# EAGLE design 2313tmpcontroller (EAGLE 7.1.0)
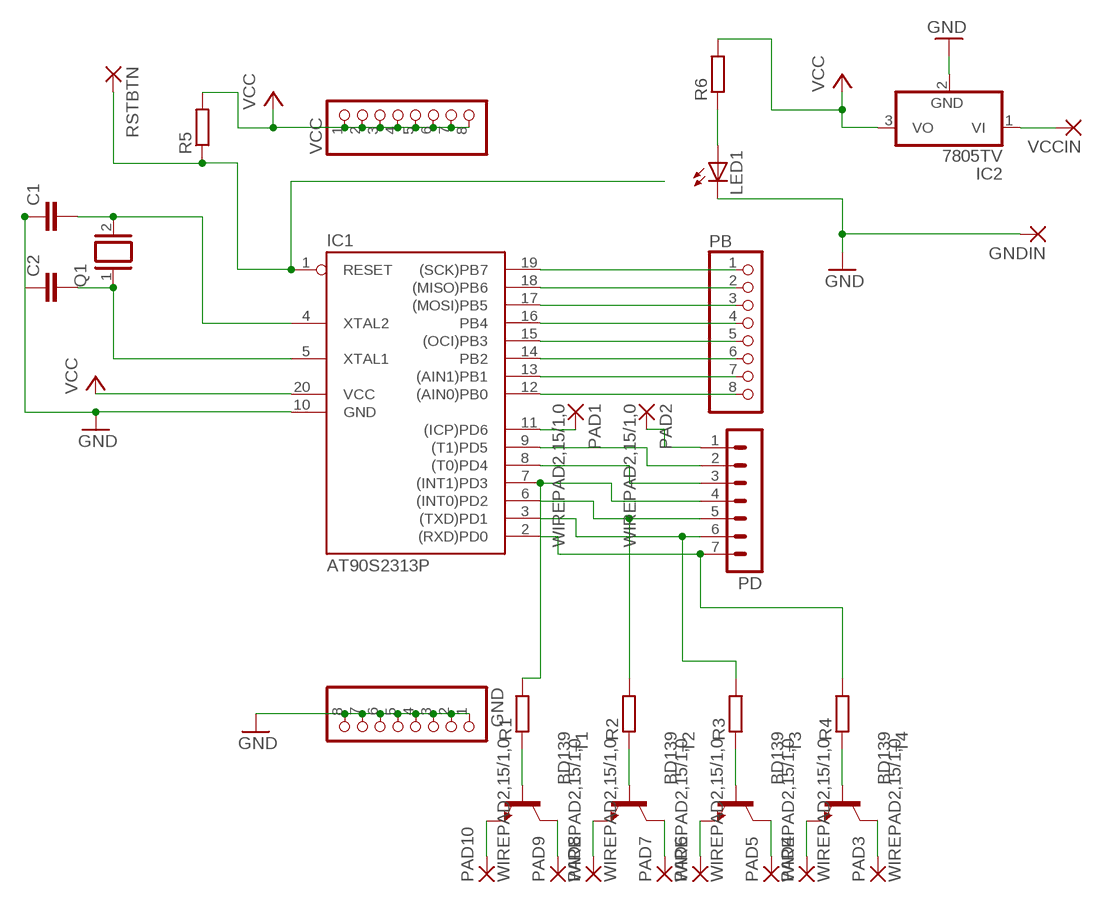
[diagram p0: schematic, sheet 1]

## Parts
C1  C2,5-3  [C2.5-3]
C2  C2,5-3  [C2.5-3]
GND  PINHD-1X8  [1X08]
GNDIN  2,54/0,8  [2,54/0,8]
IC1  AT90S2313P  [DIL20]
IC2  7805TV  [TO220V]
LED1  LEDB153  [Q62902-B153]
PAD1  WIREPAD2,15/1,0  [2,15/1,0]
PAD2  WIREPAD2,15/1,0  [2,15/1,0]
PAD3  WIREPAD2,15/1,0  [2,15/1,0]
PAD4  WIREPAD2,15/1,0  [2,15/1,0]
PAD5  WIREPAD2,15/1,0  [2,15/1,0]
PAD6  WIREPAD2,15/1,0  [2,15/1,0]
PAD7  WIREPAD2,15/1,0  [2,15/1,0]
PAD8  WIREPAD2,15/1,0  [2,15/1,0]
PAD9  WIREPAD2,15/1,0  [2,15/1,0]
PAD10  WIREPAD2,15/1,0  [2,15/1,0]
PB  PINHD-1X8  [1X08]
PD  MA07-1  [MA07-1]
Q1  XTAL/S  [QS]
R1  R-EU_0207/7  [0207/7]
R2  R-EU_0207/7  [0207/7]
R3  R-EU_0207/7  [0207/7]
R4  R-EU_0207/7  [0207/7]
R5  R-EU_0207/7  [0207/7]
R6  R-EU_0207/7  [0207/7]
RSTBTN  2,54/0,8  [2,54/0,8]
T1  BD139  [TO126]
T2  BD139  [TO126]
T3  BD139  [TO126]
T4  BD139  [TO126]
VCC  PINHD-1X8  [1X08]
VCCIN  2,54/0,8  [2,54/0,8]

## Nets
GND: C1.1 C2.1 GND.1 GND.2 GND.3 GND.4 GND.5 GND.6 GND.7 GND.8 GNDIN.1(P) IC1.10(GND) IC2.2(GND) LED1.K(C)
N$1: IC1.12((AIN0)PB0) PB.8
N$2: IC1.13((AIN1)PB1) PB.7
N$3: IC1.14(PB2) PB.6
N$4: IC1.15((OCI)PB3) PB.5
N$5: IC1.16(PB4) PB.4
N$6: IC1.17((MOSI)PB5) PB.3
N$7: IC1.18((MISO)PB6) PB.2
N$8: IC1.19((SCK)PB7) PB.1
N$9: IC1.2((RXD)PD0) PD.7 R4.2
N$10: IC1.3((TXD)PD1) PD.6 R3.2
N$11: IC1.6((INT0)PD2) PD.5 R2.2
N$12: IC1.7((INT1)PD3) PD.4 R1.2
N$13: IC1.8((T0)PD4) PD.3
N$14: IC1.9((T1)PD5) PD.2
N$15: IC1.11((ICP)PD6) PAD1.1(P)
N$16: C2.2 IC1.5(XTAL1) Q1.1
N$17: C1.2 IC1.4(XTAL2) Q1.2
N$18: R1.1 T1.3(B)
N$19: IC1.1(RESET) R5.1 RSTBTN.1(P)
N$20: R2.1 T2.3(B)
N$21: R3.1 T3.3(B)
N$22: R4.1 T4.3(B)
N$23: PAD10.1(P) T1.1(E)
N$24: PAD9.1(P) T1.2(C)
N$25: PAD8.1(P) T2.1(E)
N$26: PAD7.1(P) T2.2(C)
N$27: PAD6.1(P) T3.1(E)
N$28: PAD5.1(P) T3.2(C)
N$29: PAD4.1(P) T4.1(E)
N$30: PAD3.1(P) T4.2(C)
N$31: PAD2.1(P) PD.1
N$32: LED1.A R6.1
N$33: IC2.1(VI) VCCIN.1(P)
VCC: IC1.20(VCC) IC2.3(VO) R5.2 R6.2 VCC.1 VCC.2 VCC.3 VCC.4 VCC.5 VCC.6 VCC.7 VCC.8

## Library data of the parts
C1 C2 = capacitor-wima:C: CAPACITOR naming: grid - package width
GND PB VCC = pinhead:PINHD-1X8: PIN HEADER
GNDIN RSTBTN VCCIN = wirepad:2,54/0,8: THROUGH-HOLE PAD
IC1 = atmel:AT90S2313: MICROCONTROLLER 2 Kbytes FLASH 128 bytes SRAM 128 bytes EEPROM UART; OC_FARNELL: unknown; OC_NEWARK: unknown
IC2 = linear:78*: Positive VOLTAGE REGULATOR Source: http://cache.national.com/ds/LM/LM78L05.pdf http://www.fairchildsemi.com/ds/LM/LM7805.pdf
LED1 = led:LED: LED OSRAM: - CHIPLED LG R971, LG N971, LY N971, LG Q971, LY Q971, LO R971, LY R971 LH N974, LH R974 LS Q976, LO Q976, LY Q976 LO Q996 - Hyper CHIPLED LW Q18S LB Q993, LB Q99A, LB R99A - SideLED LS A670, LO A670, LY A670, LG A670, LP A670 LB A673, LV A673, LT A673, LW A673 LH A674 LY A675 LS A676, LA A676, LO A676, LY A676, LW A676 LS A679, LY A679, LG A679 - Hyper Micro SIDELED® LS Y876, LA Y876, LO Y876, LY Y876 LT Y87S - SmartLED LW L88C, LW L88S LB L89C, LB L89S, LG L890 LS L89K, LO L89K, LY L89K LS L896, LA L896, LO L896, LY L896 - TOPLED LS T670, LO T670, LY T670, LG T670, LP T670 LSG T670, LSP T670, LSY T670, LOP T670, LYG T670 LG T671, LOG T671, LSG T671 LB T673, LV T673, LT T673, LW T673 LH T674 LS T676, LA T676, LO T676, LY T676, LB T676, LH T676, LSB T676, LW T676 LB T67C, LV T67C, LT T67C, LS T67K, LO T67K, LY T67K, LW E67C LS E67B, LA E67B, LO E67B, LY E67B, LB E67C, LV E67C, LT E67C LW T67C LS T679, LY T679, LG T679 LS T770, LO T770, LY T770, LG T770, LP T770 LB T773, LV T773, LT T773, LW T773 LH T774 LS E675, LA E675, LY E675, LS T675 LS T776, LA T776, LO T776, LY T776, LB T776 LHGB T686 LT T68C, LB T68C - Hyper Mini TOPLED® LB M676 - Mini TOPLED Santana® LG M470 LS M47K, LO M47K, LY M47K Source: http://www.osram.convergy.de LUXEON: - LUMILED® LXK2-PW12-R00, LXK2-PW12-S00, LXK2-PW14-U00, LXK2-PW14-V00 LXK2-PM12-R00, LXK2-PM12-S00, LXK2-PM14-U00 LXK2-PE12-Q00, LXK2-PE12-R00, LXK2-PE12-S00, LXK2-PE14-T00, LXK2-PE14-U00 LXK2-PB12-K00, LXK2-PB12-L00, LXK2-PB12-M00, LXK2-PB14-N00, LXK2-PB14-P00, LXK2-PB14-Q00 LXK2-PR12-L00, LXK2-PR12-M00, LXK2-PR14-Q00, LXK2-PR14-R00 LXK2-PD12-Q00, LXK2-PD12-R00, LXK2-PD12-S00 LXK2-PH12-R00, LXK2-PH12-S00 LXK2-PL12-P00, LXK2-PL12-Q00, LXK2-PL12-R00 Source: www.luxeon.com KINGBRIGHT: KA-3528ASYC Source: www.kingbright.com
PAD1-PAD10 = wirepad:WIREPAD: Wire PAD connect wire on PCB
PD = con-lstb:MA07-1: PIN HEADER; OC_FARNELL: unknown; OC_NEWARK: unknown
Q1 = special:XTAL/S: CRYSTAL
R1-R6 = rcl:R-EU_: RESISTOR, European symbol
T1-T4 = transistor:BD139: NPN TRANSISTOR

## Board
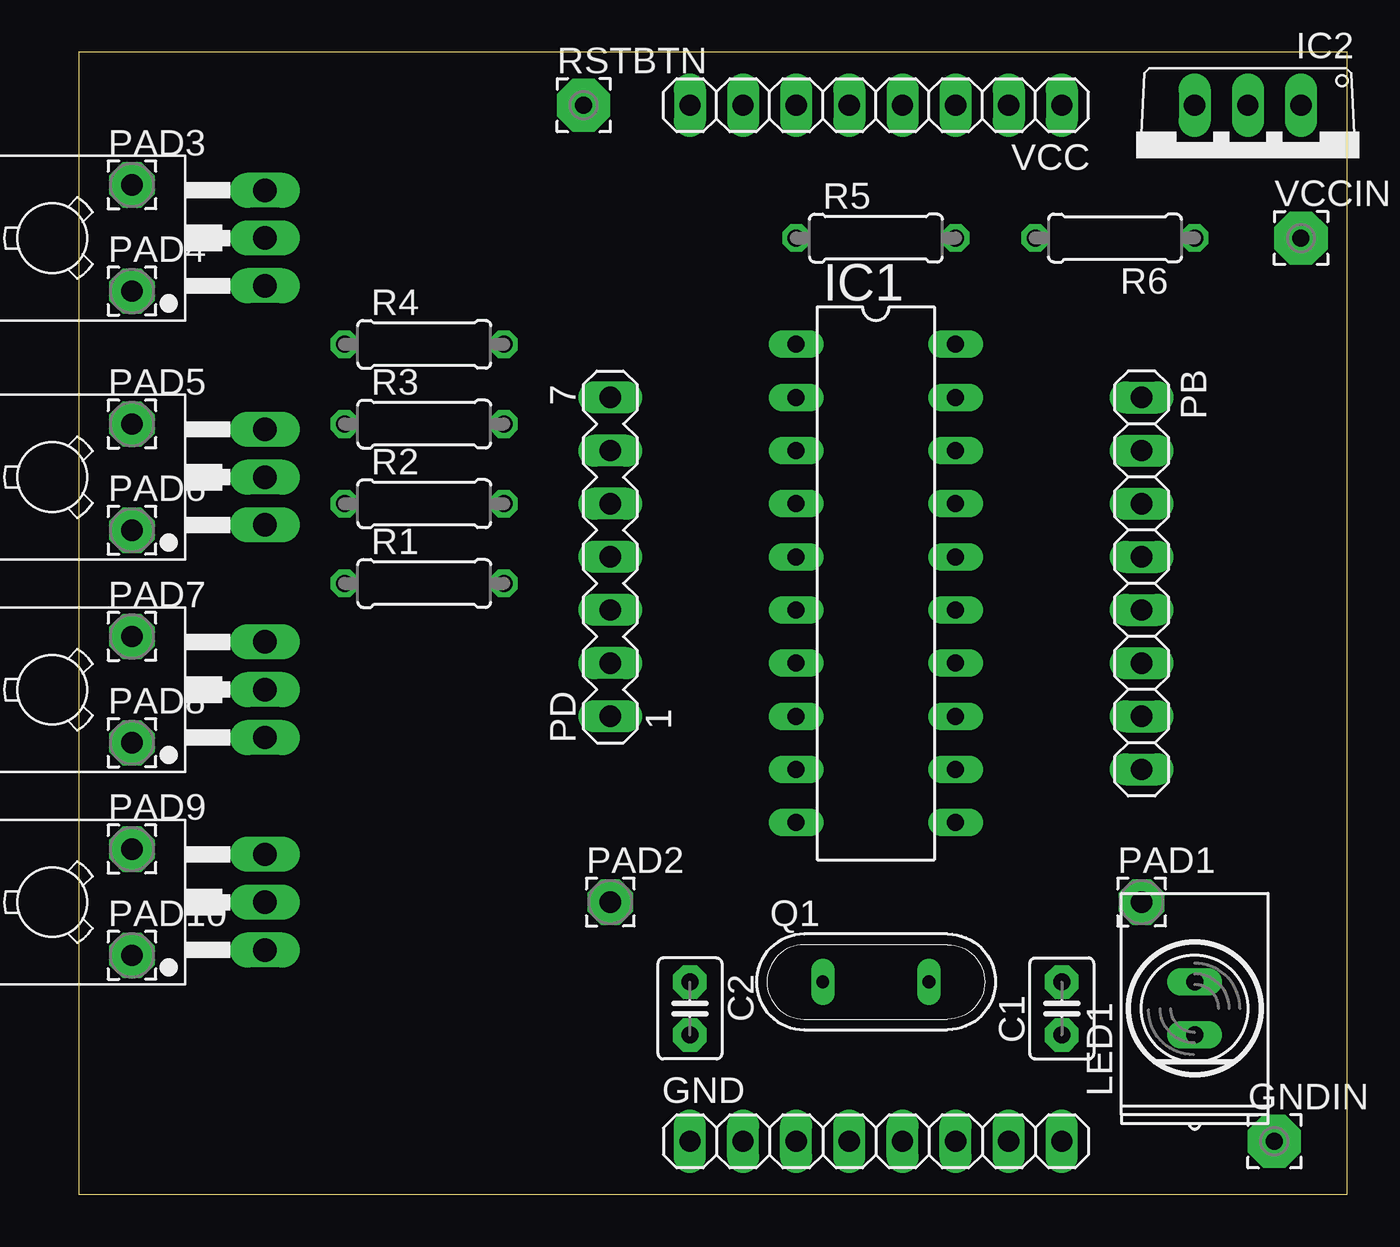
[diagram p1: board, top side]
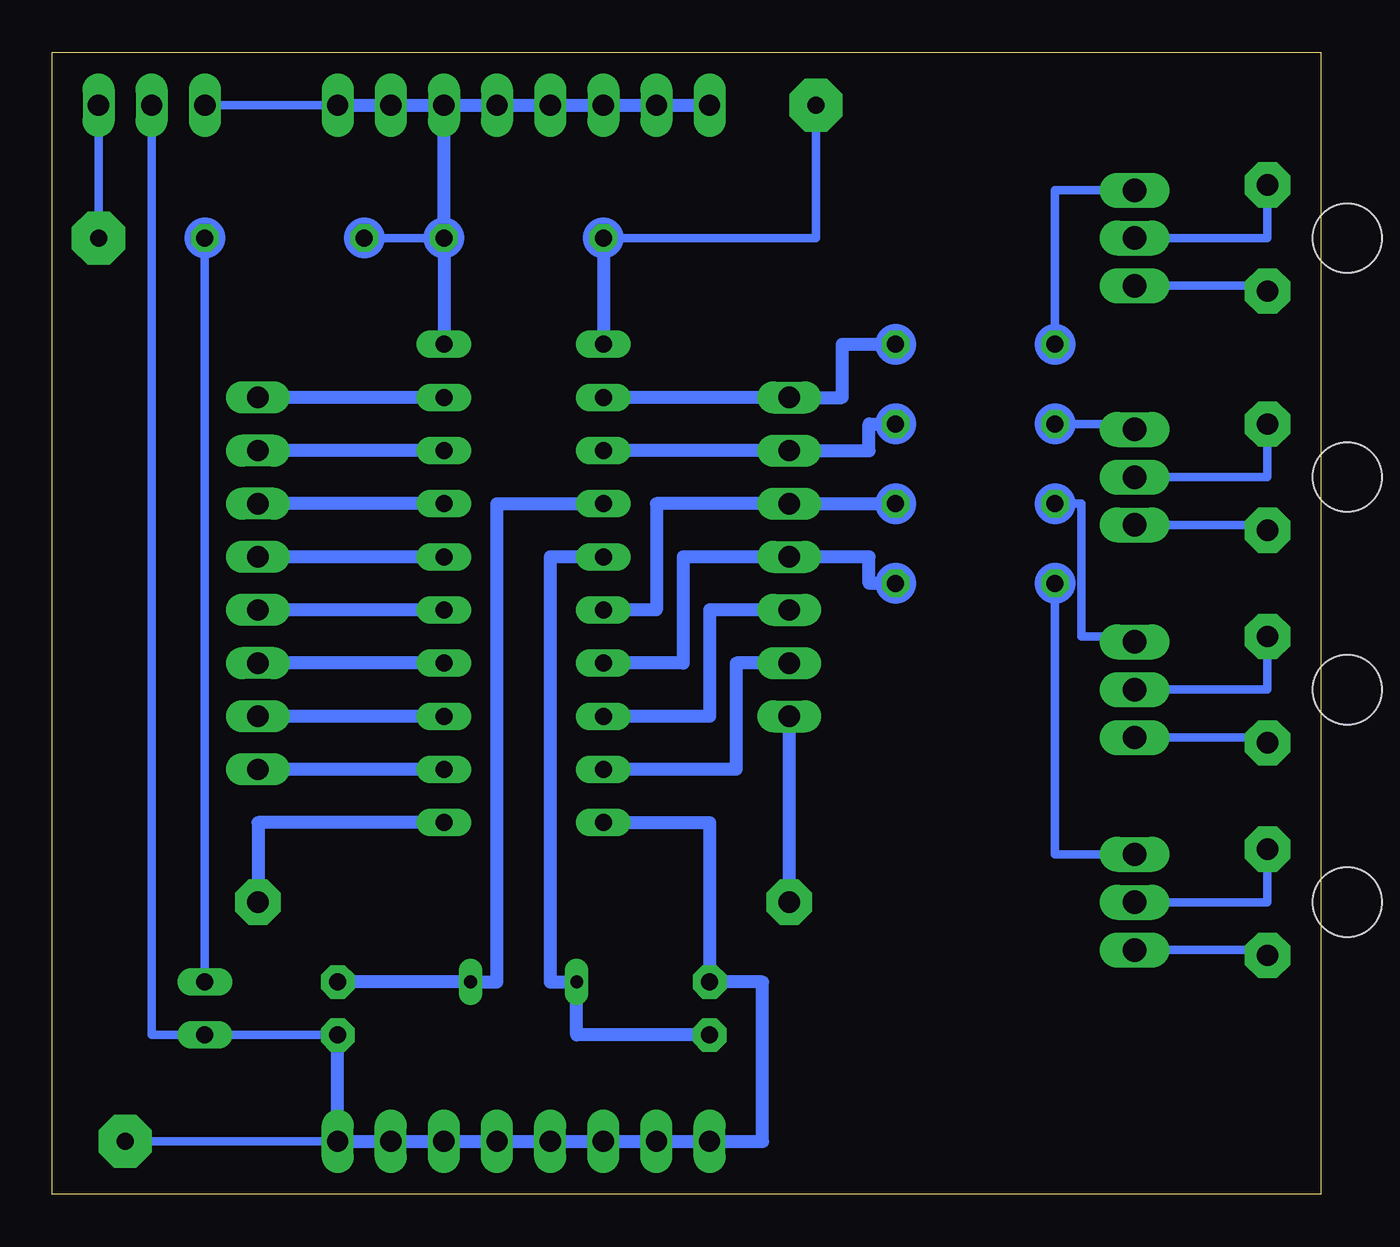
[diagram p2: board, bottom side, seen from below]

Size 60.63 x 54.6 mm. Coordinates in mm from the lower left corner, seen from the top.
Outline: 0,0 60.63,0 60.63,54.6 0,54.6 0,0
Copper layers (1*16): Top 0.035mm / dielectric 1.5mm / Bottom 0.035mm
Design rules "default": minimum track width 10mil, minimum drill 24mil, track to track 8mil, track to pad 8mil, pad to pad 8mil, via to via 8mil, smd to smd 8mil, copper to edge 40mil, drill to drill 8mil, minimum pad ring 10mil, minimum via ring 8mil, stop-mask expansion 4mil, vias tented up to drill 0mil, thermal gap 10mil

### Footprints (pad centres in the part's own frame; a part is rotated, then mirrored left to right if it is on the bottom)
C2.5-3 = drill 0.813 pad 1.6 octagon: 1 -1.27,0; 2 1.27,0
1X08 = drill 1.016 long: 1 -8.89,0; 2 -6.35,0; 3 -3.81,0; 4 -1.27,0; 5 1.27,0; 6 3.81,0; 7 6.35,0; 8 8.89,0
2,54/0,8 = drill 0.813 pad 2.54 octagon: 1 0,0
DIL20 = drill 0.813 long: 1 -11.43,-3.81; 2 -8.89,-3.81; 3 -6.35,-3.81; 4 -3.81,-3.81; 5 -1.27,-3.81; 6 1.27,-3.81; 7 3.81,-3.81; 8 6.35,-3.81; 9 8.89,-3.81; 10 11.43,-3.81; 11 11.43,3.81; 12 8.89,3.81; 13 6.35,3.81; 14 3.81,3.81; 15 1.27,3.81; 16 -1.27,3.81; 17 -3.81,3.81; 18 -6.35,3.81; 19 -8.89,3.81; 20 -11.43,3.81
TO220V = drill 1.016 long: 1 -2.54,-2.54; 2 0,-2.54; 3 2.54,-2.54
Q62902-B153 = drill 0.813 long: A 1.27,0; K -1.27,0
2,15/1,0 = drill 1.016 pad 2.159 octagon: 1 0,0
MA07-1 = drill 1.016 long: 1 -7.62,0; 2 -5.08,0; 3 -2.54,0; 4 0,0; 5 2.54,0; 6 5.08,0; 7 7.62,0
QS = drill 0.61 long: 1 -2.54,0; 2 2.54,0
0207/7 = drill 0.813 octagon: 1 -3.81,0; 2 3.81,0
TO126 = drill 1.118 long: 1 -2.286,-5.08; 2 0,-5.08; 3 2.286,-5.08 | hole 3.302: 0,5.08

### Placement (x,y rotation side)
C1  46.99,8.89 90 top
C2  29.21,8.89 270 top
GND  38.1,2.54 0 top
GNDIN  57.15,2.54 0 top
IC1  38.1,29.21 270 top
IC2  55.88,49.53 180 top
LED1  53.34,8.89 90 top
PAD1  50.8,13.97 0 top
PAD2  25.4,13.97 0 top
PAD3  2.54,48.26 0 top
PAD4  2.54,43.18 0 top
PAD5  2.54,36.83 0 top
PAD6  2.54,31.75 0 top
PAD7  2.54,26.67 0 top
PAD8  2.54,21.59 0 top
PAD9  2.54,16.51 0 top
PAD10  2.54,11.43 0 top
PB  50.8,29.21 270 top
PD  25.4,30.48 90 top
Q1  38.1,10.16 0 top
R1  16.51,29.21 0 top
R2  16.51,33.02 0 top
R3  16.51,36.83 0 top
R4  16.51,40.64 0 top
R5  38.1,45.72 0 top
R6  49.53,45.72 180 top
RSTBTN  24.13,52.07 0 top
T1  3.81,13.97 90 top
T2  3.81,24.13 90 top
T3  3.81,34.29 90 top
T4  3.81,45.72 90 top
VCC  38.1,52.07 180 top
VCCIN  58.42,45.72 0 top

### Tracks (layer width: path | path; a pad name or v marks a point on that pad's centre or on a via)
GND
  Bottom 0.406: C1.1 LED1.K 55.88,7.62 IC2.2 | GNDIN.1 GND.8
  Bottom 0.61: IC1.10 29.21,17.78 C2.1 26.67,10.16 26.67,2.54 GND.1 GND.2 GND.3 GND.4 GND.5 GND.6 GND.7 GND.8 C1.1
N$1
  Bottom 0.61: IC1.12 PB.8
N$2
  Bottom 0.61: IC1.13 PB.7
N$3
  Bottom 0.61: IC1.14 PB.6
N$4
  Bottom 0.61: IC1.15 PB.5
N$5
  Bottom 0.61: IC1.16 PB.4
N$6
  Bottom 0.61: IC1.17 PB.3
N$7
  Bottom 0.61: IC1.18 PB.2
N$8
  Bottom 0.61: IC1.19 PB.1
N$9
  Bottom 0.61: IC1.2 PD.7 22.86,38.1 22.86,40.64 | 22.86,40.64 R4.2 22.86,40.64
N$10
  Bottom 0.61: IC1.3 PD.6 21.59,35.56 21.59,36.83 R3.2
N$11
  Bottom 0.61: IC1.6 31.75,27.94 31.75,33.02 PD.5 R2.2
N$12
  Bottom 0.61: IC1.7 30.48,25.4 30.48,30.48 PD.4 21.59,30.48 21.59,29.21 R1.2
N$13
  Bottom 0.61: PD.3 29.21,27.94 29.21,22.86 IC1.8
N$14
  Bottom 0.61: PD.2 27.94,25.4 27.94,20.32 IC1.9
N$15
  Bottom 0.61: IC1.11 50.8,17.78 PAD1.1
N$16
  Bottom 0.61: IC1.5 36.83,30.48 36.83,10.16 Q1.1 35.56,7.62 C2.2
N$17
  Bottom 0.61: IC1.4 39.37,33.02 39.37,10.16 Q1.2 C1.2
N$18
  Bottom 0.406: R1.1 12.7,16.26 T1.3
N$19
  Bottom 0.406: RSTBTN.1 24.13,45.72 R5.1
  Bottom 0.61: R5.1 IC1.1
N$20
  Bottom 0.406: R2.1 11.43,33.02 11.43,26.67 8.89,26.67 T2.3
N$21
  Bottom 0.406: R3.1 8.89,36.83 T3.3
N$22
  Bottom 0.406: R4.1 12.7,48.01 T4.3
N$23
  Bottom 0.406: T1.1 2.54,11.68 PAD10.1
N$24
  Bottom 0.406: T1.2 2.54,13.97 PAD9.1
N$25
  Bottom 0.406: T2.1 2.54,21.84 PAD8.1
N$26
  Bottom 0.406: T2.2 2.54,24.13 PAD7.1
N$27
  Bottom 0.406: T3.1 2.54,32 PAD6.1
N$28
  Bottom 0.406: T3.2 2.54,34.29 PAD5.1
N$29
  Bottom 0.406: T4.1 2.54,43.43 PAD4.1
N$30
  Bottom 0.406: T4.2 2.54,45.72 PAD3.1
N$31
  Bottom 0.61: PAD2.1 PD.1
N$32
  Bottom 0.406: LED1.A R6.1
N$33
  Bottom 0.406: VCCIN.1 IC2.1
VCC
  Bottom 0.406: R6.2 R5.2 | IC2.3 VCC.1
  Bottom 0.61: IC1.20 R5.2 VCC.3 | VCC.1 VCC.2 VCC.3 | VCC.3 VCC.4 VCC.5 VCC.6 VCC.7 VCC.8
(copper drawn outside any net)
  shapes: Bottom circle x12